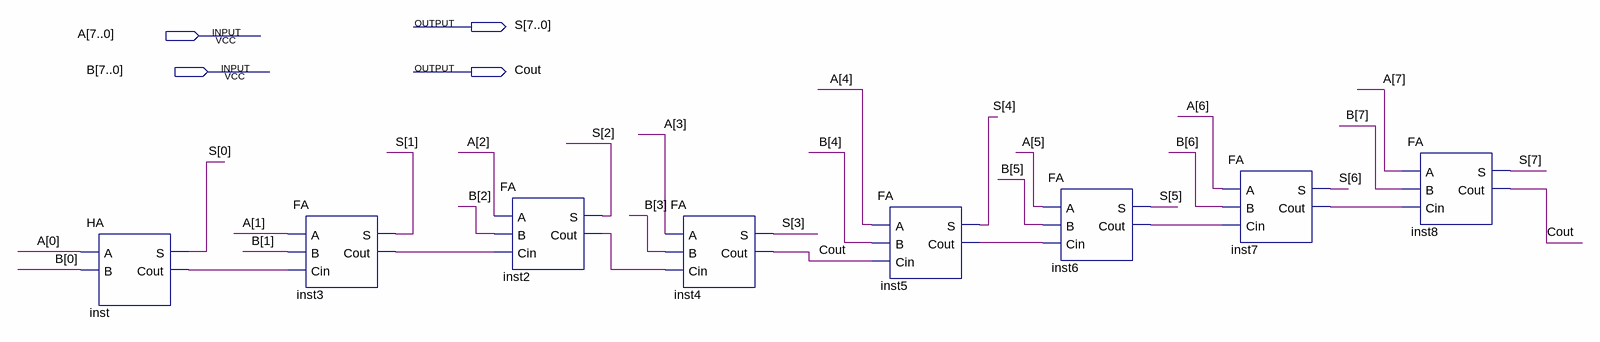
[diagram p0: schematic sheet]
// Quartus schematic RCA_neander.bdf as structural Verilog: 8 symbols, 4 pins
module RCA_neander (
  input  [7:0] A,
  input  [7:0] B,
  output [7:0] S,
  output Cout
);

  wire inst2_cout, inst3_cout, inst5_cout, inst6_cout, inst7_cout, inst_cout;

  HA inst (.A(A[0]), .B(B[0]), .S(S[0]), .Cout(inst_cout));
  FA inst3 (.A(A[1]), .B(B[1]), .Cin(inst_cout), .S(S[1]), .Cout(inst3_cout));
  FA inst2 (.A(A[2]), .B(B[2]), .Cin(inst3_cout), .S(S[2]), .Cout(inst2_cout));
  FA inst4 (.A(A[3]), .B(B[3]), .Cin(inst2_cout), .S(S[3]), .Cout(Cout));
  FA inst5 (.A(A[4]), .B(B[4]), .Cin(Cout), .S(S[4]), .Cout(inst5_cout));
  FA inst6 (.A(A[5]), .B(B[5]), .Cin(inst5_cout), .S(S[5]), .Cout(inst6_cout));
  FA inst7 (.A(A[6]), .B(B[6]), .Cin(inst6_cout), .S(S[6]), .Cout(inst7_cout));
  FA inst8 (.A(A[7]), .B(B[7]), .Cin(inst7_cout), .S(S[7]), .Cout(Cout));
endmodule
